# EAGLE design NotSoSmartWatch-BASIC-BOTTOM (EAGLE 9.6.2)
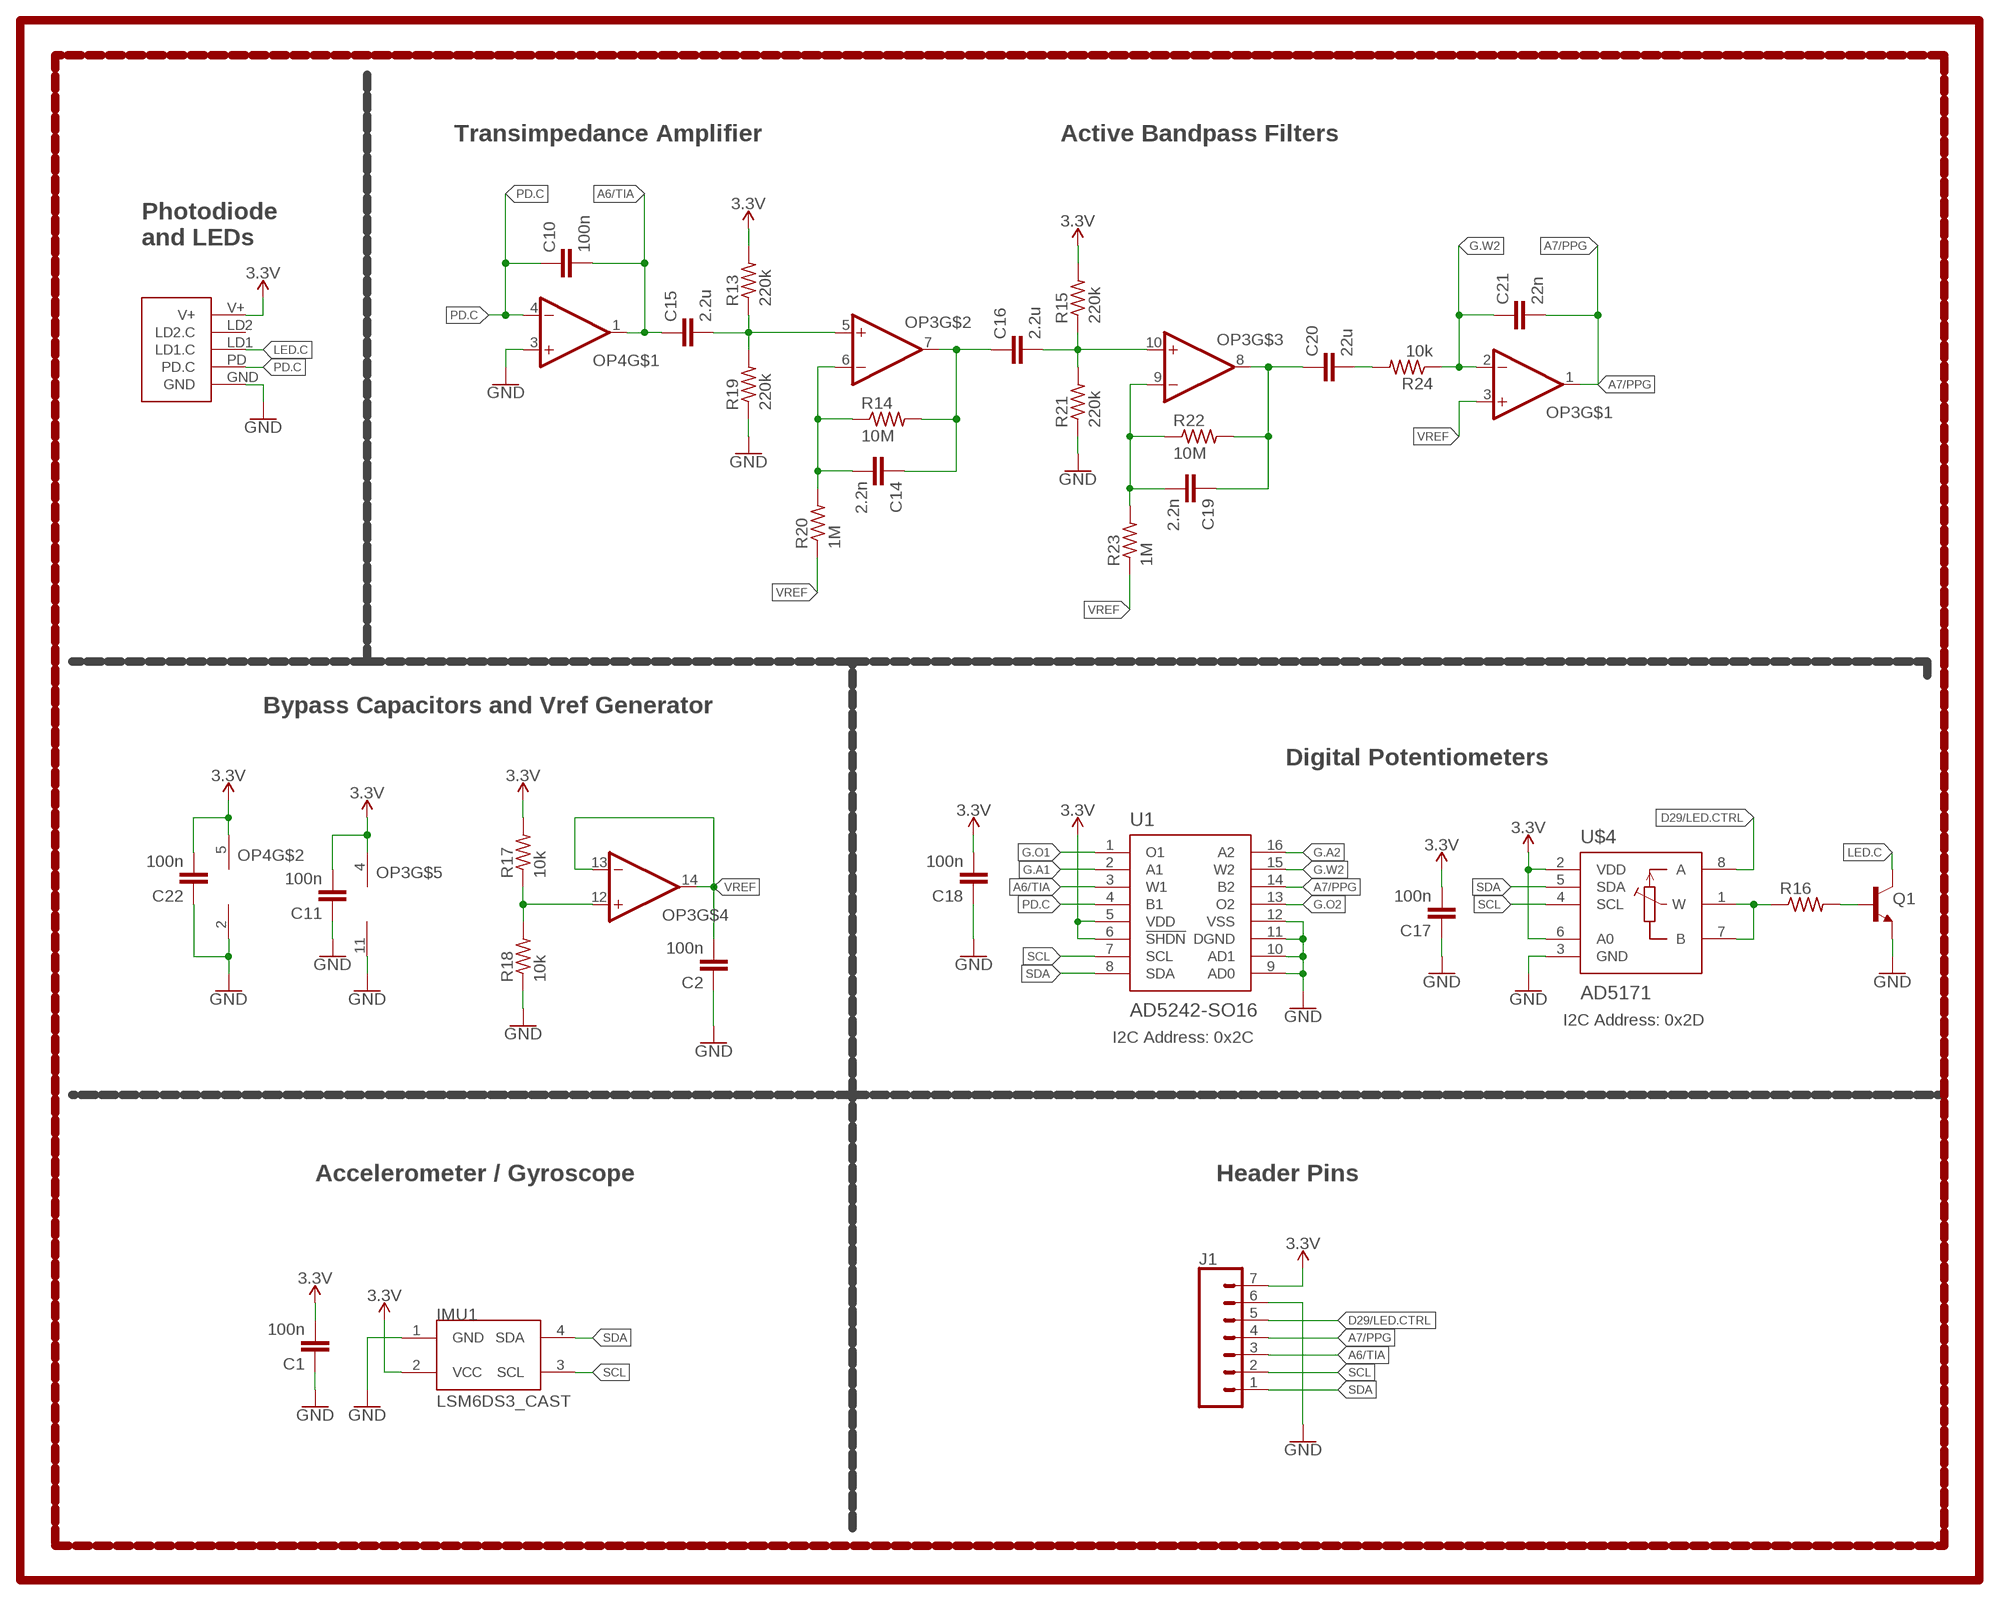
[diagram p0: schematic, sheet 1]

## Parts
C1  100n  CAPACITOR0603  [C0603]
C2  100n  CAPACITOR0603  [C0603]
C10  100n  CAPACITOR0603  [C0603]
C11  100n  CAPACITOR0603  [C0603]
C14  2.2n  CAPACITOR0603  [C0603]
C15  2.2u  CAPACITOR0603  [C0603]
C16  2.2u  CAPACITOR0603  [C0603]
C17  100n  CAPACITOR0603  [C0603]
C18  100n  CAPACITOR0603  [C0603]
C19  2.2n  CAPACITOR0603  [C0603]
C20  22u  CAPACITOR0603  [C0603]
C21  22n  CAPACITOR0603  [C0603]
C22  100n  CAPACITOR0603  [C0603]
IMU1  LSM6DS3_CAST  [LSM6DS3_CAST]
J1  CONN_07-1.27MM  [1X07_1.27MM]
OP3  OP-QUAD-SO14  [SO14]
OP4  OP-SINGLEOT  [SOT23-5]
Q1  NPN-GENERIC  [SOT23-3]
R13  220k  RESISTOR0603  [R0603]
R14  10M  RESISTOR0603  [R0603]
R15  220k  RESISTOR0603  [R0603]
R16  RESISTOR0603  [R0603]
R17  10k  RESISTOR0402  [R0402]
R18  10k  RESISTOR0402  [R0402]
R19  220k  RESISTOR0603  [R0603]
R20  1M  RESISTOR0603  [R0603]
R21  220k  RESISTOR0603  [R0603]
R22  10M  RESISTOR0603  [R0603]
R23  1M  RESISTOR0603  [R0603]
R24  10k  RESISTOR0603  [R0603]
U1  AD5242-SO16  [SO16]
U$3  PPG.MODULE.2  [PPG.MODULE.2]
U$4  AD5171  [SOT-23-8]

## Nets
3.3V: C1.2 C11.2 C17.2 C18.2 C22.2 IMU1.2(VCC) J1.7 OP3.4(V+) OP4.5(V+) R13.2 R15.2 R17.2 U1.5(VDD) U1.6(!SHDN) U$3.V+ U$4.2(VDD) U$4.6(A0)
A6/TIA: C10.2 C15.1 J1.3 OP4.1(OUT) U1.3(W1)
A7/PPG: C21.2 J1.4 OP3.1(OUT) U1.14(B2)
D29/LED.CTRL: J1.5 U$4.8(A)
G.A1: U1.2(A1)
G.A2: U1.16(A2)
G.O1: U1.1(O1)
G.O2: U1.13(O2)
G.W2: C21.1 OP3.2(-IN) R24.1 U1.15(W2)
GND: C1.1 C2.1 C11.1 C17.1 C18.1 C22.1 IMU1.1(GND) J1.6 OP3.11(V-) OP4.2(V-) OP4.3(+IN) Q1.2(E) R18.1 R19.1 R21.1 U1.9(AD0) U1.10(AD1) U1.11(DGND) U1.12(VSS) U$3.GND U$4.3(GND)
LED.C: Q1.3(C) U$3.LD1(LD1.C)
N$8: Q1.1(B) R16.2
N$9: R16.1 U$4.1(W) U$4.7(B)
N$10: OP3.12(+IN) R17.1 R18.2
N$13: C15.2 OP3.5(+IN) R13.1 R19.2
N$15: C14.2 OP3.6(-IN) R14.1 R20.2
N$16: C14.1 C16.1 OP3.7(OUT) R14.2
N$17: C16.2 OP3.10(+IN) R15.1 R21.2
N$18: C19.2 OP3.9(-IN) R22.1 R23.2
N$19: C19.1 C20.1 OP3.8(OUT) R22.2
N$20: C20.2 R24.2
PD.C: C10.1 OP4.4(-IN) U1.4(B1) U$3.PD(PD.C)
SCL: IMU1.3(SCL) J1.2 U1.7(SCL) U$4.4(SCL)
SDA: IMU1.4(SDA) J1.1 U1.8(SDA) U$4.5(SDA)
VREF: C2.2 OP3.3(+IN) OP3.13(-IN) OP3.14(OUT) R20.1 R23.1
Unconnected: U$3.LD2(LD2.C)

## Notes on the sheet
- Transimpedance Amplifier | Active Bandpass Filters
- Photodiode
  and LEDs
- Bypass Capacitors and Vref Generator
- Digital Potentiometers
- I2C Address: 0x2D
- I2C Address: 0x2C
- Accelerometer / Gyroscope | Header Pins

## Library data of the parts
C1 C2 C10 C11 C14-C22 = LinnesLab-Passives:CAPACITOR
IMU1 = LinnesLab-Sensors:LSM6DS3_CAST
J1 = LinnesLab-Connectors:CONN_07: Multi connection point. Often used as Generic Header-pin footprint for 0.1 inch spaced/style header connections On any of the 0.1 inch spaced packages, you can populate with these: Break Away Headers - Straight <https://www.sparkfun.com/products/116> (PRT-00116) Break Away Male Headers - Right Angle <https://www.sparkfun.com/products/553> (PRT-00553) Female Headers <https://www.sparkfun.com/products/115> (PRT-00115) Break Away Headers - Machine Pin <https://www.sparkfun.com/products/117> (PRT-00117) Break Away Female Headers - Swiss Machine Pin <https://www.sparkfun.com/products/743> (PRT-00743) For SCREWTERMINALS and SPRING TERMINALS visit here: Screw Terimnals on SparkFun.com <https://www.sparkfun.com/search/results?term=Screw+Terminals> (5mm/3.5mm/2.54mm spacing) This device is also useful as a general connection point to wire up your design to another part of your project. Our various solder wires solder well into these plated through hole pads. Hook-Up Wire - Assortment (Stranded, 22 AWG) <https://www.sparkfun.com/products/11375> (PRT-11375) Hook-Up Wire - Assortment (Solid Core, 22 AWG) <https://www.sparkfun.com/products/11367> (PRT-11367) View the entire wire category on our website here <https://www.sparkfun.com/categories/141> Special notes: Molex polarized connector foot print use with SKU : PRT-08231 with associated crimp pins and housings. 1MM SMD Version SKU: PRT-10208 NOTES ON THE VARIANTS LOCK and LOCK_LONGPADS... This footprint was designed to help hold the alignment of a through-hole component (i.e. 6-pin header) while soldering it into place. You may notice that each hole has been shifted either up or down by 0.005 of an inch from it's more standard position (which is a perfectly straight line). This slight alteration caused the pins (the squares in the middle) to touch the edges of the holes. Because they are alternating, it causes a "brace" to hold the component in place. 0.005 has proven to be the perfect amount of "off-center" position when using our standard breakaway headers. Although looks a little odd when you look at the bare footprint, once you have a header in there, the alteration is very hard to notice. Also,if you push a header all the way into place, it is covered up entirely on the bottom side.
OP3 = LinnesLab-AnalogIC:OP-QUAD: General symbol and footprints for Quad Op Amps. Use with any standard general purpose op amp.
OP4 = LinnesLab-AnalogIC:OP-SINGLE: Single Op Amp 2.7V to 6.0V Single Supply CMOS Source: http://ww1.microchip.com/downloads/en/DeviceDoc/21314g.pdf
Q1 = LinnesLab-DiscreteSemi:NPN
R13-R24 = LinnesLab-Passives:RESISTOR
U1 = LinnesLab-DigitalIC:AD5242
U$3 = LinnesLab-Connectors:PPG.MODULE.2: Digi-Key Part Number: S9014E-50-ND Manufacturer Part Number: GRPB501VWVN-RC Description: 1mm insulation height 0.05in pitch 50 positions
U$4 = LinnesLab-DigitalIC:AD5171

## Board
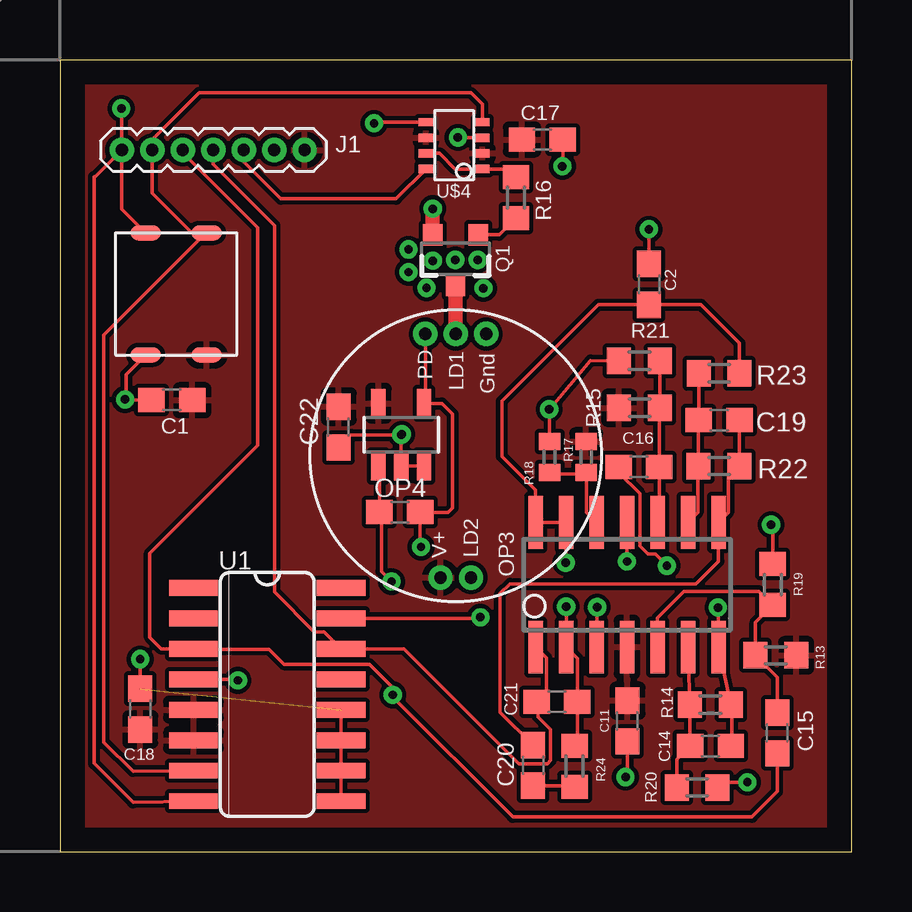
[diagram p1: board, top side]
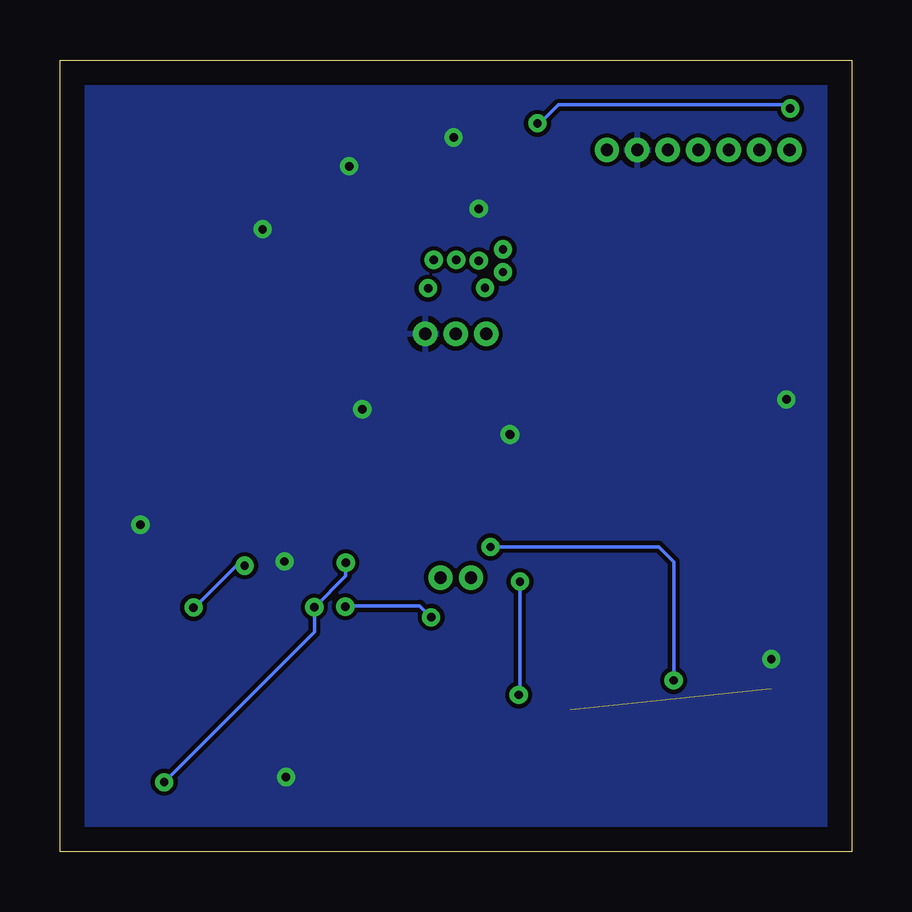
[diagram p2: board, bottom side, seen from below]

Size 33 x 33 mm. Coordinates in mm from the lower left corner, seen from the top.
Outline: 0,0 33,0 33,33 0,33 0,0
Copper layers (1*16): Top 0.035mm / dielectric 1.5mm / Bottom 0.035mm
Design rules "default": minimum track width 6mil, minimum drill 0.35mm, track to track 6mil, track to pad 6mil, pad to pad 6mil, via to via 6mil, smd to smd 6mil, copper to edge 40mil, drill to drill 6mil, minimum pad ring 10mil, minimum via ring 8mil, stop-mask expansion 4mil, vias tented up to drill 0mil, thermal gap 10mil

### Footprints (pad centres in the part's own frame; a part is rotated, then mirrored left to right if it is on the bottom)
C0603 = smd 1.1 x 1: 1 -0.85,0; 2 0.85,0
LSM6DS3_CAST = smd 0.635 x 1.27: 1 -2.54,1.27; 2 -2.54,-1.27; 3 2.54,-1.27; 4 2.54,1.27
1X07_1.27MM = drill 0.508 pad 1: 1 0,0; 2 1.27,0; 3 2.54,0; 4 3.81,0; 5 5.08,0; 6 6.35,0; 7 7.62,0
SO14 = smd 0.6 x 2.2: 1 -3.81,-2.6; 2 -2.54,-2.6; 3 -1.27,-2.6; 4 0,-2.6; 5 1.27,-2.6; 6 2.54,-2.6; 7 3.81,-2.6; 8 3.81,2.6; 9 2.54,2.6; 10 1.27,2.6; 11 0,2.6; 12 -1.27,2.6; 13 -2.54,2.6; 14 -3.81,2.6
SOT23-5 = smd 0.6 x 1.2: 1 -0.95,-1.306; 2 0,-1.306; 3 0.95,-1.306; 4 0.95,1.306; 5 -0.95,1.306
SOT23-3 = smd 0.8 x 0.9: 1 -0.95,-1; 2 0.95,-1; 3 0,1.1
R0603 = smd 1 x 1.1: 1 -0.85,0; 2 0.85,0
R0402 = smd 0.7 x 0.9: 1 -0.65,0; 2 0.65,0
SO16 = smd 0.66 x 2.032: 1 -4.445,-3.073; 2 -3.175,-3.073; 3 -1.905,-3.073; 4 -0.635,-3.073; 5 0.635,-3.073; 6 1.905,-3.073; 7 3.175,-3.073; 8 4.445,-3.073; 9 4.445,3.073; 10 3.175,3.073; 11 1.905,3.073; 12 0.635,3.073; 13 -0.635,3.073; 14 -1.905,3.073; 15 -3.175,3.073; 16 -4.445,3.073
PPG.MODULE.2 = drill 0.508 pad 0.94: GND 1.27,5.08; LD1 0,5.08; LD2 0.635,-5.08; PD -1.27,5.08; V+ -0.635,-5.08
SOT-23-8 = smd 0.35 x 0.6: 1 -0.991,-1.176; 2 -0.341,-1.176; 3 0.309,-1.176; 4 0.959,-1.176; 5 0.959,1.176; 6 0.309,1.176; 7 -0.341,1.176; 8 -0.991,1.176

### Placement (x,y rotation side)
C1  4.67,18.82 0 top
C2  24.55,23.65 270 top
C10  14.17,14.15 180 top
C11  23.66,5.44 90 top
C14  27.12,4.41 180 top
C15  29.91,4.94 90 top
C16  24.13,16.04 0 top
C17  20.11,29.68 180 top
C18  3.35,5.94 270 top
C19  27.48,17.99 180 top
C20  19.72,3.59 270 top
C21  20.72,6.25 180 top
C22  11.62,17.7 90 top
IMU1  4.84,23.24 90 top
J1  2.58,29.25 0 top
OP3  23.64,11.12 0 top
OP4  14.23,17.38 0 top
Q1  16.49,24.71 180 top
R13  29.84,8.18 0 top
R14  27.12,6.13 0 top
R15  24.16,18.5 180 top
R16  19.01,27.26 270 top
R17  21.94,16.45 90 top
R18  20.41,16.45 270 top
R19  29.71,11.13 270 top
R20  26.56,2.67 180 top
R21  24.16,20.46 0 top
R22  27.47,16.07 0 top
R23  27.48,19.94 180 top
R24  21.45,3.56 270 top
U1  8.64,6.55 270 top
U$3  16.5,16.5 0 top
U$4  16.43,29.45 90 top

### Tracks (layer width: path | path; a pad name or v marks a point on that pad's centre or on a via)
3.3V
  pour Top (isolate 0.178): 1,32 32,32 32,1 1,1
A6/TIA  (via drill 0.35)
  Top 0.152: v13.82,11.25 13.4,11.68 13.4,14.08 C10.2 13.32,16.03 OP4.1 | C15.1 29.91,2.5 28.85,1.45 18.88,1.45 13.87,6.45 v13.87,6.53 13.87,6.84 12.9,7.81 9.34,7.81 8.72,8.43 5.59,8.43 U1.3 4.23,8.45 3.75,8.93 3.75,12.43 8.25,16.93 8.25,26 5.12,29.13 J1.3
  Bottom 0.152: v13.87,6.53 13.82,6.58 v13.82,11.25
A7/PPG
  Top 0.152: OP3.1 20.28,8.08 20.28,6.66 19.92,6.3 | 19.92,6.3 C21.2 | 19.92,6.3 19.92,5.62 20.45,5.09 20.45,3.8 20.32,3.67 19.12,3.67 14.34,8.45 U1.14 | U1.14 | U1.14 11,9.16 10.6,9.16 8.95,10.82 8.95,26.09 6.39,28.65 J1.4
D29/LED.CTRL
  Top 0.152: U$4.8 14.01,27.21 9.2,27.21 7.66,28.76 J1.5
G.W2  (via drill 0.35)
  Top 0.152: R24.1 21.57,4.52 C21.1 21.57,8.06 OP3.2 v21.1,10.21 | v17.52,9.77 17.48,9.72 U1.15
  Bottom 0.152: v17.52,9.77 18,10.24 21.07,10.24 v21.1,10.21
GND  (via drill 0.35)  (1 unrouted)
  Top 0.152: 23.65,14.53 23.46,14.33 23.46,13.91 OP3.11 v23.64,12.1 | R18.1 20.42,18.42 v20.4,18.44 22.12,20.48 R21.1 | R19.1 29.72,13.56 v29.65,13.62 | C11.1 23.66,3.19 v23.58,3.11 | v14.23,17.37 OP4.2 OP4.3 15.23,16.12 | v14.23,17.37 v14.25,17.39 | C22.1 12.14,17.37 v14.23,17.37 | C18.1 3.35,7.66 3.34,7.65 v3.34,8.02 | C1.1 2.75,18.82 | 2.75,18.82 2.74,18.82 v2.71,18.85 | U$4.3 16.6,29.76 v16.59,29.77 | IMU1.1 2.75,19.88 2.75,18.82 | C17.1 20.96,28.59 v20.94,28.57 | U1.12 U1.11 U1.10 U1.9 | v24.55,25.94 C2.1
  Top 0.61: Q1.2 v15.54,26.79 v15.54,26.8
  pour Bottom (isolate 0.178): 32.5,0.5 0.5,0.5 0.5,32.5 32.5,32.5 32.36,0.66
LED.C
  Top 0.61: U$3.LD1 16.49,21.59 Q1.3
N$1  (via drill 0.35)
  other vias: 15.28,23.5
N$2  (via drill 0.35)
  other vias: 17.65,23.48
N$3  (via drill 0.35)
  other vias: 14.53,24.16
N$4  (via drill 0.35)
  other vias: 14.53,25.1
N$5  (via drill 0.35)
  other vias: 16.48,24.67
N$6  (via drill 0.35)
  other vias: 17.41,24.67
N$7  (via drill 0.35)
  other vias: 15.54,24.63
N$8
  Top 0.152: R16.2 18.32,25.71 Q1.1
N$9
  Top 0.152: R16.1 18.66,28.46 U$4.1 16.48,28.46 15.83,29.11 U$4.7
N$10
  Top 0.152: R18.2 20.48,15.73 21.87,15.73 R17.1 21.95,15.81 21.95,14.14 OP3.12
N$13
  Top 0.152: C15.2 29.91,7.27 R13.1 28.99,9.56 R19.2 29.14,10.85 26,10.84 24.91,9.74 OP3.5
N$15
  Top 0.152: R20.2 25.71,3.85 C14.2 R14.1 OP3.6
N$16  (via drill 0.35)
  Top 0.152: C14.1 28,4.44 28,6.09 R14.2 OP3.7 27.44,8.54 27.45,10.19 v27.43,10.18 | v25.3,11.92 24.83,12.4 24.52,12.4 24.17,12.74 24.17,14.92 23.28,15.8 C16.1
  Bottom 0.152: v27.43,10.18 27.35,10.22 27.35,10.21 25.64,11.92 v25.3,11.92
N$17
  Top 0.152: OP3.10 24.98,13.8 C16.2 24.98,18.47 R15.1 R21.2
N$18
  Top 0.152: OP3.9 26.59,14.14 26.59,16.04 R22.1 C19.2 R23.2
N$19
  Top 0.152: C20.1 18.35,5.81 18.35,10.75 18.76,11.16 26.52,11.16 27.45,12.1 OP3.8 27.86,14.14 27.86,15.61 R22.2 C19.1
N$20
  Top 0.152: R24.2 21.42,2.74 C20.2
PD.C  (via drill 0.35)
  Top 0.152: U$3.PD 15.23,18.74 OP4.4 15.92,18.68 16.37,18.23 16.37,14.33 16.18,14.14 15.04,14.14 C10.1 15.02,12.73 v15.05,12.7 | U1.4 7.37,7.18 v7.41,7.14
  Bottom 0.152: v7.41,7.14 7.41,12.08 8.04,12.7 v15.05,12.7
SCL
  Top 0.152: U1.7 3.05,3.34 1.83,4.56 1.83,21.54 6.1,25.8 IMU1.3 5.52,25.78 3.85,27.45 J1.2 3.85,29.69 5.79,31.63 17.13,31.63 17.61,31.15 U$4.4
SDA  (via drill 0.35)
  Top 0.152: U1.8 3.05,2.05 1.42,3.67 1.42,28.13 1.46,28.13 J1.1 | J1.1 2.58,26.78 IMU1.4 | v2.55,30.98 2.58,30.96 J1.1 | U$4.5 13.14,30.41 v13.09,30.36
  Bottom 0.152: v13.09,30.36 13,30.36 12.22,31.13 2.7,31.13 v2.55,30.98
VREF  (via drill 0.35)
  Top 0.152: R23.1 28.33,21.19 26.82,22.7 26.72,22.8 C2.2 22.45,22.8 18.43,18.78 18.43,16.48 19.83,15.07 OP3.14 OP3.13 21.1,12.06 v21.08,12.04 | R20.1 27.63,2.89 v28.66,2.89 | v22.39,10.19 22.39,8.55 OP3.3
  Bottom 0.152: v28.66,2.89 22.39,9.15 v22.39,10.19 21.08,11.49 v21.08,12.04